# Altium schematic sheet 12_NB-IOT_Core.SchDoc
size A3
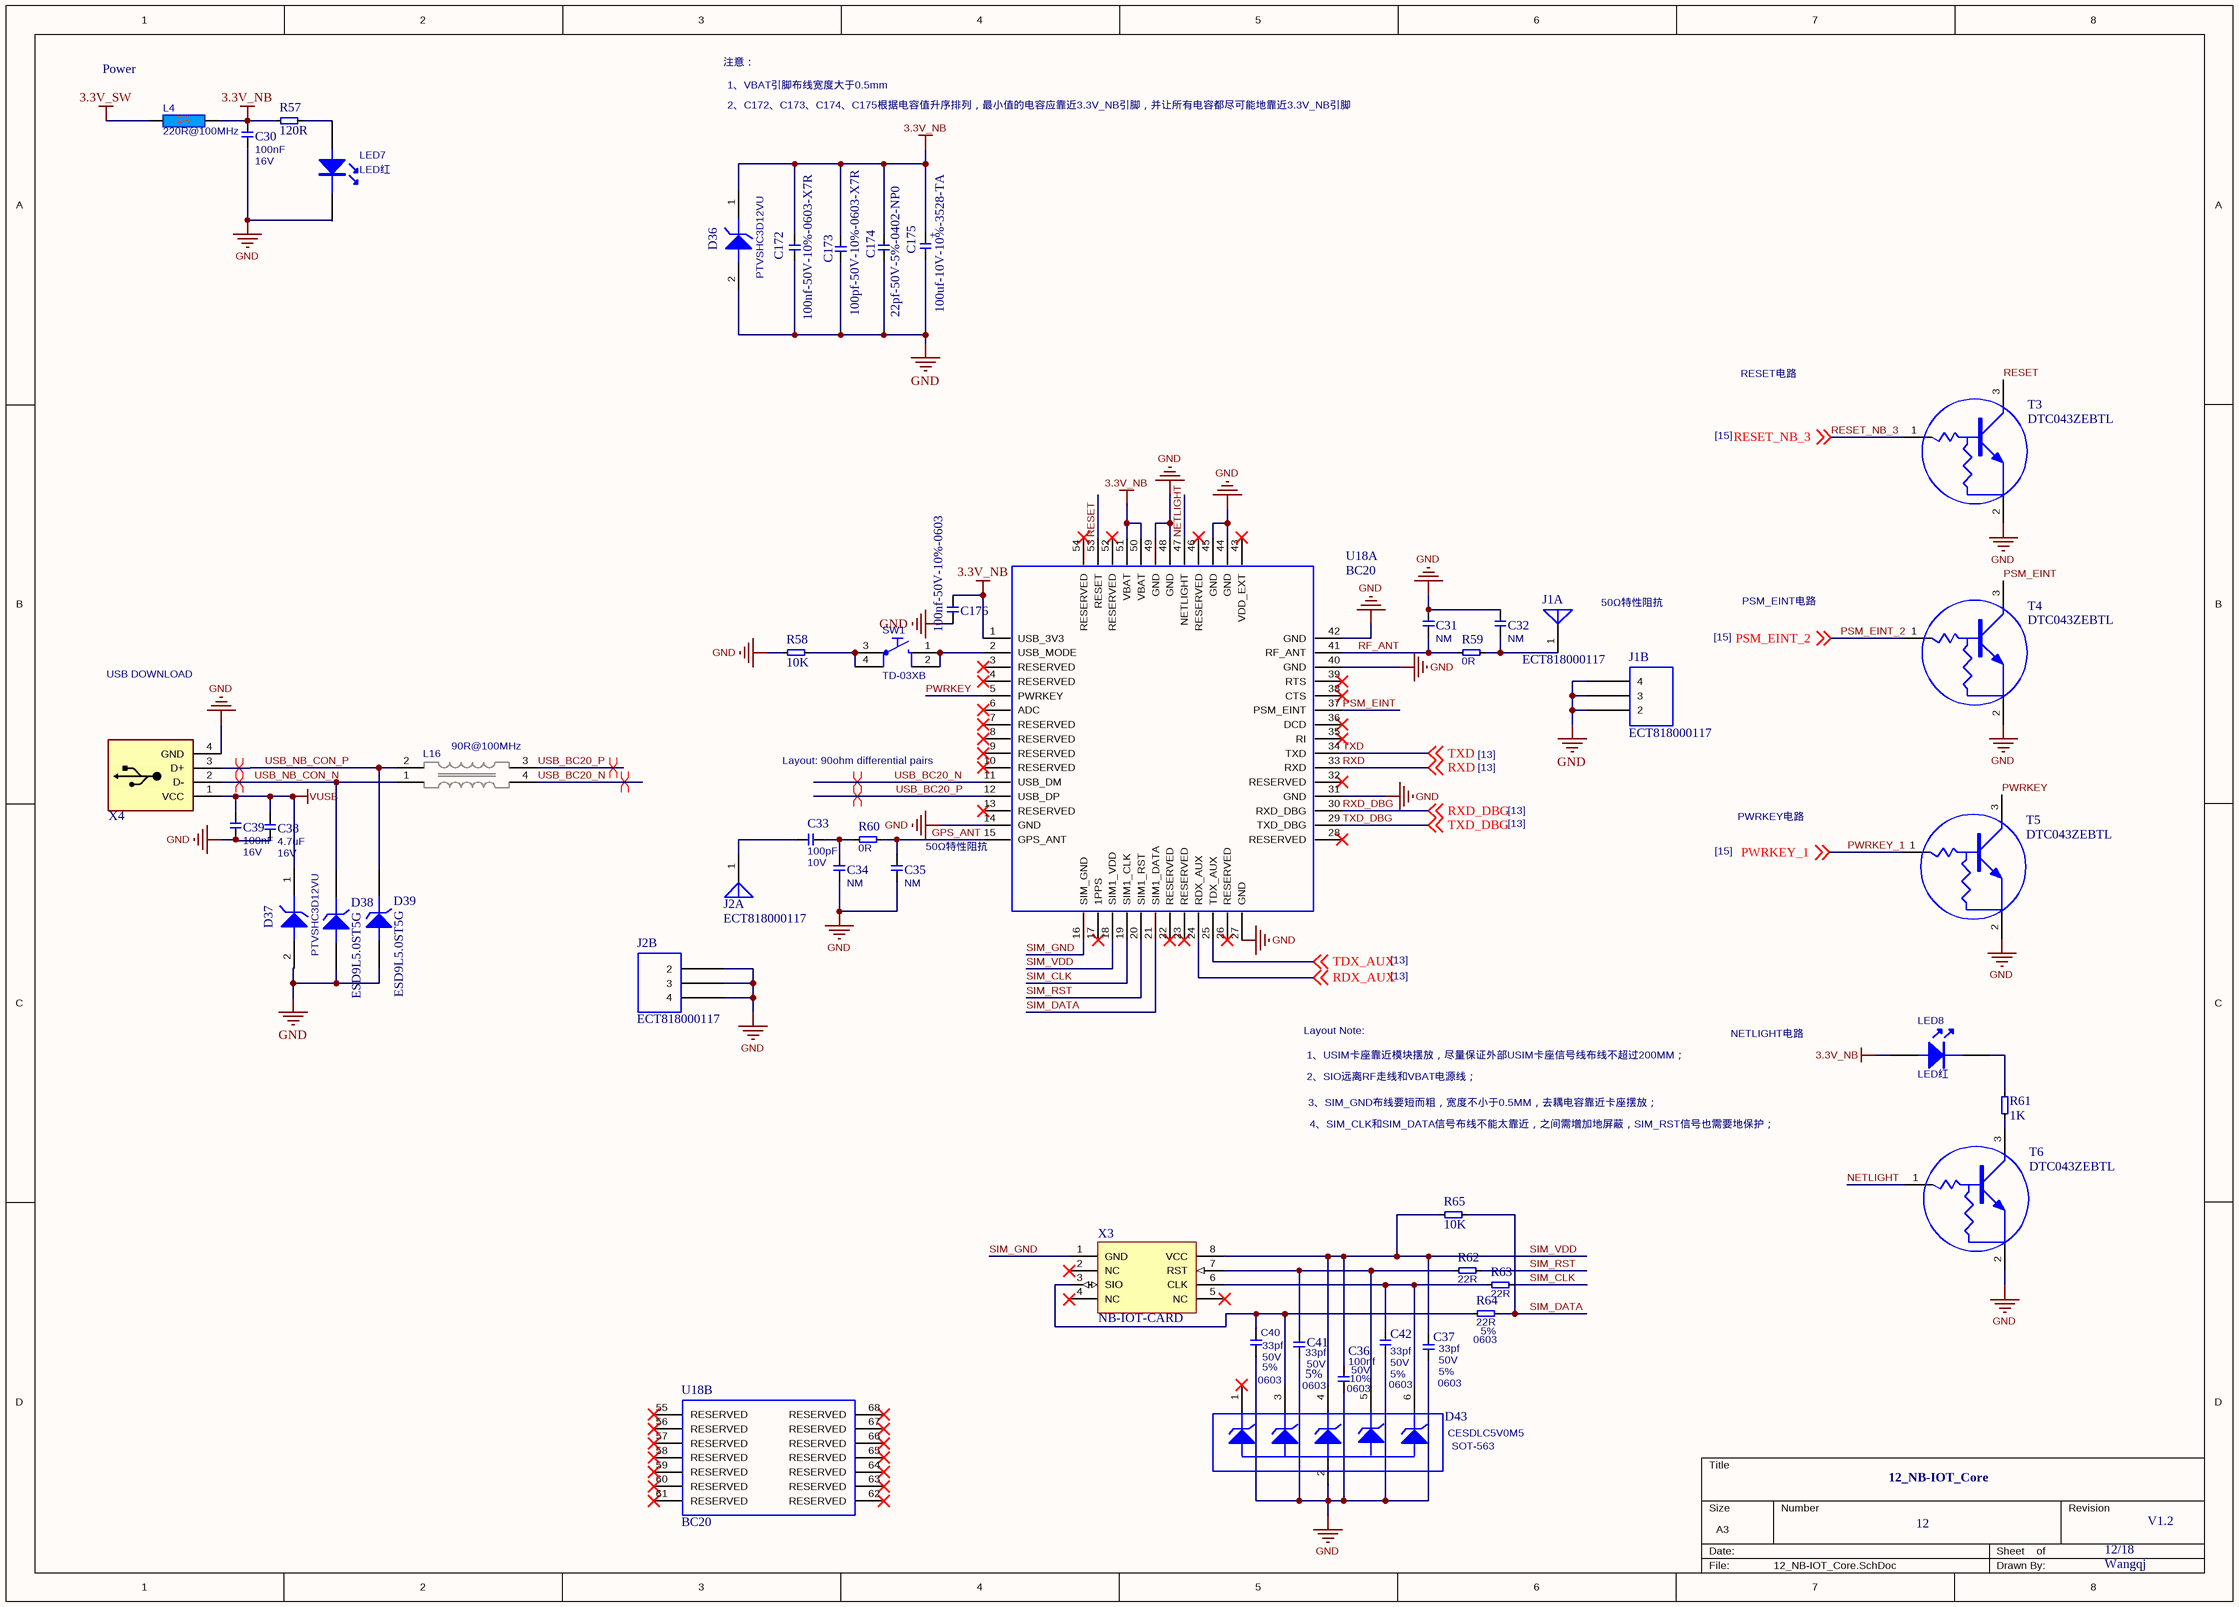
[diagram p0: 12_NB-IOT_Core.SchDoc]

## Parts
C30  Rating: 16V  [T_CAPC0603X33N]  (hidden comment: 100nF)
C31  NM  [T_CAPC0603X33N]
C32  NM  [T_CAPC0603X33N]
C33  Rating: 10V  [T_CAPC0603X33N]  (hidden comment: 100pF)
C34  NM  [T_CAPC0603X33N]
C35  NM  [T_CAPC0603X33N]
C36  value 100nf  Footprint: 0603  Rating: 50V  Tolerance: 10%  [CAPC0603]  (hidden comment: 0.1uf-50V-10%-0603)
C37  value 33pf  Tolerance: 5%  Rating: 50V  Footprint: 0603  [T_CAPC0603X33N]  (hidden comment: 33pf-50V-5%-0603)
C38  Rating: 16V  [T_CAPC0603X33N]  (hidden comment: 4.7uF)
C39  Rating: 16V  [T_CAPC0603X33N]  (hidden comment: 100nF)
C40  value 33pf  Tolerance: 5%  Rating: 50V  Footprint: 0603  [T_CAPC0603X33N]  (hidden comment: 33pf-50V-5%-0603)
C41  value 33pf  Tolerance: 5%  Rating: 50V  Footprint: 0603  [T_CAPC0603X33N]  (hidden comment: 33pf-50V-5%-0603)
C42  value 33pf  Tolerance: 5%  Rating: 50V  Footprint: 0603  [T_CAPC0603X33N]  (hidden comment: 33pf-50V-5%-0603)
C172  100nf-50V-10%-0603-X7R  [T_CAPC0603X33N]
C173  100pf-50V-10%-0603-X7R  [T_CAPC0603X33N]
C174  22pf-50V-5%-0402-NP0  [CAPC0402]
C175  100uf-10V-10%-3528-TA  [T_CAPMP3216X180N]
C176  100nf-50V-10%-0603  [T_CAPC0603X33N]
D36  PTVSHC3D12VU  [LC-SOD-323]
D37  PTVSHC3D12VU  [LC-SOD-323]
D38  ESD9L5.0ST5G  [LC-SOD-923]
D39  ESD9L5.0ST5G  [LC-SOD-923]
D43  CESDLC5V0M5  [SOT-563]
J1  ECT818000117  [IPEX2]  (parts A,B of 2)
J2  ECT818000117  [IPEX2]  (parts A,B of 2)
L4  220R@100MHz  [INDC1608X95N]
L16  90R@100MHz  [T_Murata_DLW21SN900SQ2]
LED7  LED红  [LC-0805_LED_S3]
LED8  LED红  [LC-0805_LED_S3]
R57  120R  [T_RESC0603X30N]
R58  10K  [T_RESC0603X30N]
R59  0R  [T_RESC0603X30N]
R60  0R  [T_RESC0603X30N]
R61  1K  [T_RESC0603X30N]
R62  22R  [T_RESC0603X30N]
R63  22R  [T_RESC0603X30N]
R64  value 22R  Tolerance: 5%  Footprint: 0603  [T_RESC0603X30N]  (hidden comment: 22R-5%-0603)
R65  10K  [T_RESC0603X30N]
SW1  TD-03XB  [T_WMF_TD-03XB]
T3  DTC043ZEBTL  [SOT-416FL]
T4  DTC043ZEBTL  [SOT-416FL]
T5  DTC043ZEBTL  [SOT-416FL]
T6  DTC043ZEBTL  [SOT-416FL]
U18  BC20  [BC20]  (parts A,B of 2)
X3  NB-IOT-CARD  [QFN127P600X500X90_HS-9N]
X4  CON-USB  [2.54*4p]  (value not drawn)

## Nets
3.3V_NB: C30.2 C172.2 C173.2 C174.2 C175.1 C176.1 D36.1(K) L4.2 LED8.A R57.1 U18.1(USB_3V3) U18.50(VBAT) U18.51(VBAT)
3.3V_SW: L4.1
GND: C30.1 C31.2 C32.2 C34.1 C35.1 C36.1 C37.2 C38.2 C39.2 C40.1 C41.1 C42.1 C172.1 C173.1 C174.1 C175.2 C176.2 D36.2(A) D37.2(A) D38.1(A) D39.1(A) D43.2(A) J1.2 J1.3 J1.4 J2.2 J2.3 J2.4 LED7.K R58.1 T3.2(E) T4.2(E) T5.2(E) T6.2(E) U18.14(GND) U18.27(GND) U18.31(GND) U18.40(GND) U18.42(GND) U18.44(GND) U18.45(GND) U18.48(GND) U18.49(GND) X4.4(GND)
VUSB: C38.1 C39.1 D37.1(K) X4.1(VCC)
GPS_ANT: C35.2 R60.2 U18.15(GPS_ANT)
NETLIGHT: T6.1(B) U18.47(NETLIGHT)
PSM_EINT: T4.3(C) U18.37(PSM_EINT)
PSM_EINT_2: T4.1(B) ; off-sheet PSM_EINT_2
PWRKEY: T5.3(C) U18.5(PWRKEY)
PWRKEY_1: T5.1(B) ; off-sheet PWRKEY_1
RDX_AUX: U18.24(RDX_AUX) ; off-sheet RDX_AUX
RESET: T3.3(C) U18.53(RESET)
RESET_NB_3: T3.1(B) ; off-sheet RESET_NB_3
RF_ANT: C31.1 R59.1 U18.41(RF_ANT)
RXD: U18.33(RXD) ; off-sheet RXD
RXD_DBG: U18.30(RXD_DBG) ; off-sheet RXD_DBG
SIM_CLK: R63.1 U18.19(SIM1_CLK)
SIM_DATA: R64.1 R65.2 U18.21(SIM1_DATA)
SIM_GND: U18.16(SIM_GND) X3.1(GND)
SIM_RST: R62.1 U18.20(SIM1_RST)
SIM_VDD: C36.2 C37.1 D43.4(K) R65.1 U18.18(SIM1_VDD) X3.8(VCC)
TDX_AUX: U18.25(TDX_AUX) ; off-sheet TDX_AUX
TXD: U18.34(TXD) ; off-sheet TXD
TXD_DBG: U18.29(TXD_DBG) ; off-sheet TXD_DBG
USB_BC20_N: L16.4 U18.11(USB_DM)
USB_BC20_P: L16.3 U18.12(USB_DP)
USB_NB_CON_N: D38.2(K) L16.1 X4.2(D-)
USB_NB_CON_P: D39.2(K) L16.2 X4.3(D+)
NetC32_1: C32.1 J1.1(A) R59.2
NetC33_1: C33.1 J2.1(A)
NetC33_2: C33.2 C34.2 R60.1
NetC40_2: C40.2 D43.3(K) R64.2 X3.3(SIO)
NetC41_2: C41.2 D43.5(K) R62.2 X3.7(RST)
NetC42_2: C42.2 D43.6(K) R63.2 X3.6(CLK)
NetLED7_A: LED7.A R57.2
NetLED8_K: LED8.K R61.2
NetR58_2: R58.2 SW1.3 SW1.4
NetR61_1: R61.1 T6.3(C)
NetSW1_1: SW1.1 SW1.2 U18.2(USB_MODE)

Not connected (* = marked no-connect by the designer): D43 1(K)*; U18 3(RESERVED)* 4(RESERVED)* 6(ADC)* 7(RESERVED)* 8(RESERVED)* 9(RESERVED)* 10(RESERVED)* 13(RESERVED)* 17(1PPS)* 22(RESERVED)* 23(RESERVED)* 26(RESERVED)* 28(RESERVED)* 32(RESERVED)* 35(RI)* 36(DCD)* 38(CTS)* 39(RTS)* 43(VDD_EXT)* 46(RESERVED)* 52(RESERVED)* 54(RESERVED)* 55(RESERVED)* 56(RESERVED)* 57(RESERVED)* 58(RESERVED)* 59(RESERVED)* 60(RESERVED)* 61(RESERVED)* 62(RESERVED)* 63(RESERVED)* 64(RESERVED)* 65(RESERVED)* 66(RESERVED)* 67(RESERVED)* 68(RESERVED)*; X3 2(NC)* 4(NC) 5(NC)*

## Layout directives
differential pair: USB_BC20_N, USB_BC20_P, USB_NB_CON_N, USB_NB_CON_P

## Notes on the sheet
- (near L4) Power
- 注意：
- 1、VBAT引脚布线宽度大于0.5mm
- 2、C172、C173、C174、C175根据电容值升序排列，最小值的电容应靠近3.3V_NB引脚，并让所有电容都尽可能地靠近3.3V_NB引脚
- RESET电路
- [15]
- (near J1) 50Ω特性阻抗
- PSM_EINT电路
- USB DOWNLOAD
- Layout: 90ohm differential pairs
- [13]
- PWRKEY电路
- 50Ω特性阻抗
- Layout Note:
- 1、USIM卡座靠近模块摆放，尽量保证外部USIM卡座信号线布线不超过200MM；
- NETLIGHT电路
- 2、SIO远离RF走线和VBAT电源线；
- 3、SIM_GND布线要短而粗，宽度不小于0.5MM，去耦电容靠近卡座摆放；
- 4、SIM_CLK和SIM_DATA信号布线不能太靠近，之间需增加地屏蔽，SIM_RST信号也需要地保护；
- 12_NB-IOT_Core
- 12
- 12/18
- V1.2
- Wangqj
- (in symbol C-TA) +

## Library data of the parts
C30 C39 = C-X7R-100nF-16V-10%-0603: Capacitor Ceramic X7R 100nF 16V 10% 0603; Tolerance: 10%; Type: X7R; Value: 100nF
C31-C35 = C-X7R-100pF-10V-20%-0603: Capacitor Ceramic X7R 100pF 10V 20% 0603; Tolerance: 20%; Type: X7R
  C31 C32 C35: Value: NM; Rating: 10V
  C33: Value: 100pF
  C34: Value: NM
C36 = C-Ceramic: Type: X7R
C37 C40 C41 = C-NP0-33pF-50V-5%-0603: Capacitor Ceramic NP0 33pF 50V 5% 0603; Type: NP0
C38 = C-4.7uF-16V-10%-0603-X5R: Capacitor Ceramic X5R 4.7uF 16V 10% 0603; Tolerance: 10%; Type: X5R; Value: 4.7uF
C42 = C-NP0-33pF-50V-5%-0603: Type: NP0
C172-C174 C176 = C-X7R-100nF-16V-10%-0603: Tolerance: 10%; Type: X7R; Value: 100nF; Rating: 16V
C175 = C-TA: Tolerance: 20%; Type: TA; Rating: 10V; Value: 1uF
D36 D37 = Diode_TVS: TVS Diode
D38 D39 = ZENER3: TVS Diode
D43 = Diode_ESD_Array: ESD Protection Diode Array; Part Number: CESDLC5V0M5
J1 J2 = ANTENNA: Generic Antenna
L4 = L-220R@100MHz-2A-25%-0603: 220R@100MHz 2A EMI FILTER; Tolerance: 25%; Rating: 2A; Value: 220R@100MHz
L16 = L-Murata-DLW21SN900SQ2-90R@100MHz-330mA-25%: Common Mode Choke High Speed 90R 330mA; Manufacturer Name: Murata; Tolerance: 25%; Rating: 330mA; Manufacturer Part No.: DLW21SN900SQ2; Value: 90R@100MHz
LED7 LED8 = LED: 0805LED绿
R57 = R-120R-63mW-5%-0603: Resistor 120 ohm 63mW 5% 0603; Rating: 63mW; Tolerance: 5%; Value: 120R
R58 R65 = R-10KR-63mW-5%-0603: Resistor 10 Kohm 63mW 5% 0603; Value: 10KR; Rating: 63mW; Tolerance: 5%
R59 R60 = R-0R-63mW-1%-0603: Resistor 0 ohm 63mW 1% 0603; Rating: 63mW; Tolerance: 1%; Value: 0R
R61 = R-1KR-63mW-5%-0603: Resistor 1 Kohm 63mW 5% 0603; Rating: 63mW; Tolerance: 5%; Value: 1K
R62-R64 = R-22R-63mW-5%-0603: Resistor 22 ohm 63mW 5% 0603; Rating: 63mW
  R62 R63: Tolerance: 5%; Value: 22R
SW1 = SW-WMF-TD-03XB: Push Button; Manufacturer Name: WMF; Rating: 50mA; Manufacturer Part No.: TD-03XB
T3-T6 = NPN_Bias_Resistor: Bias Resistor Build-in NPN Transistor
X3 = NB-IOT-CARD: NB-IOT CARD
X4 = CON-USB: USB  Connector; Manufacturer Name: FCI; Manufacturer Part No.: 73725-0110BLF; No. of ways: 4
U18 = BC20: PCB DECAL: *; BOMRemark: *; Geometry.Height: *; Manufacturer: *; Part Description: *; Part Number: *; Value: *